# Altium schematic sheet SIM.SchDoc: Air724UG 参考设计
size 594 x 419 mm; DESIGNER: Loukanghua; REV: V1.0
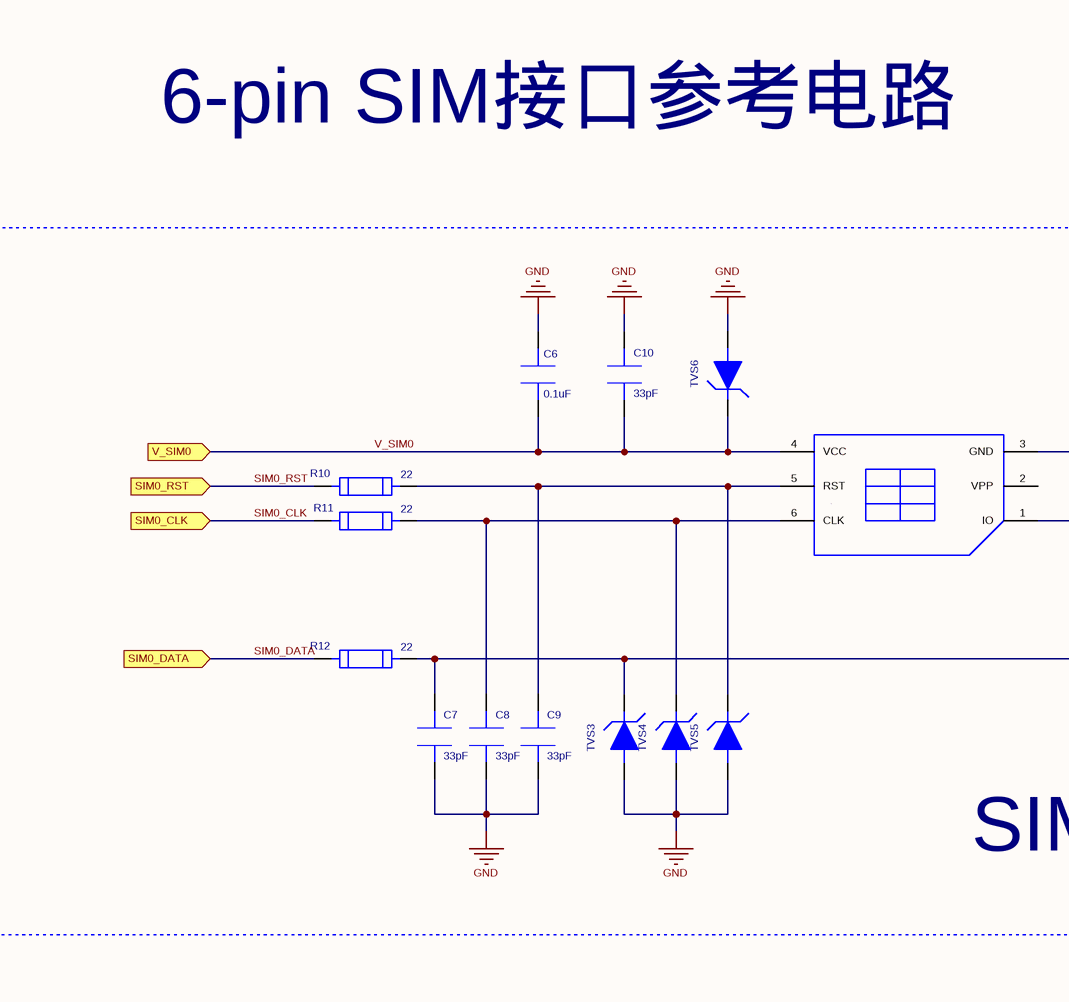
[diagram p0: SIM.SchDoc, top left]
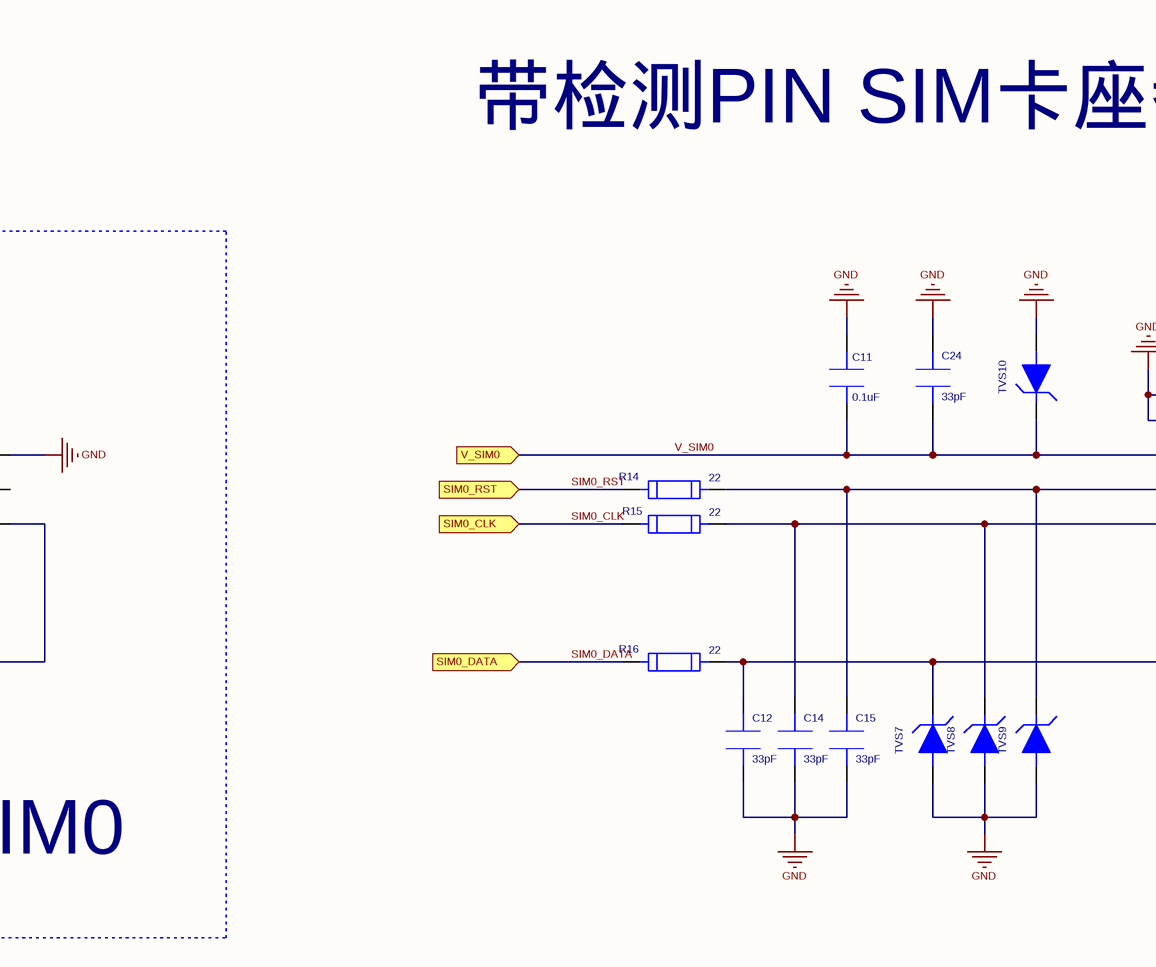
[diagram p1: SIM.SchDoc, top middle]
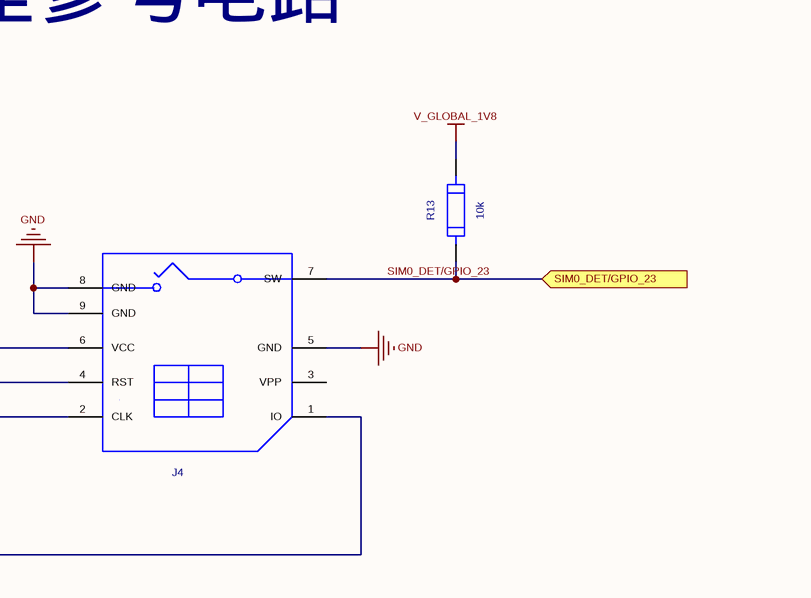
[diagram p2: SIM.SchDoc, top right]
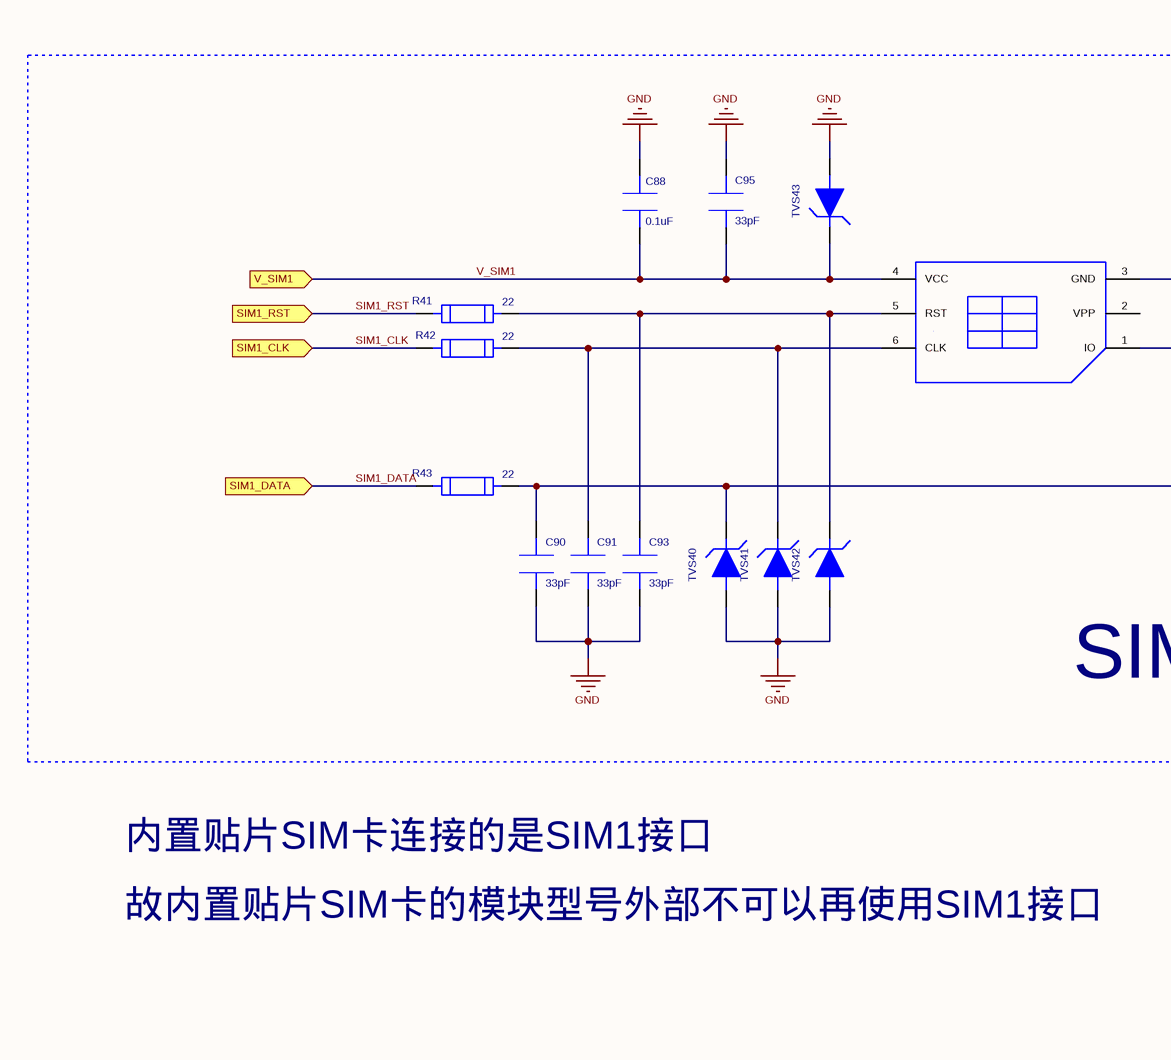
[diagram p3: SIM.SchDoc, bottom left]
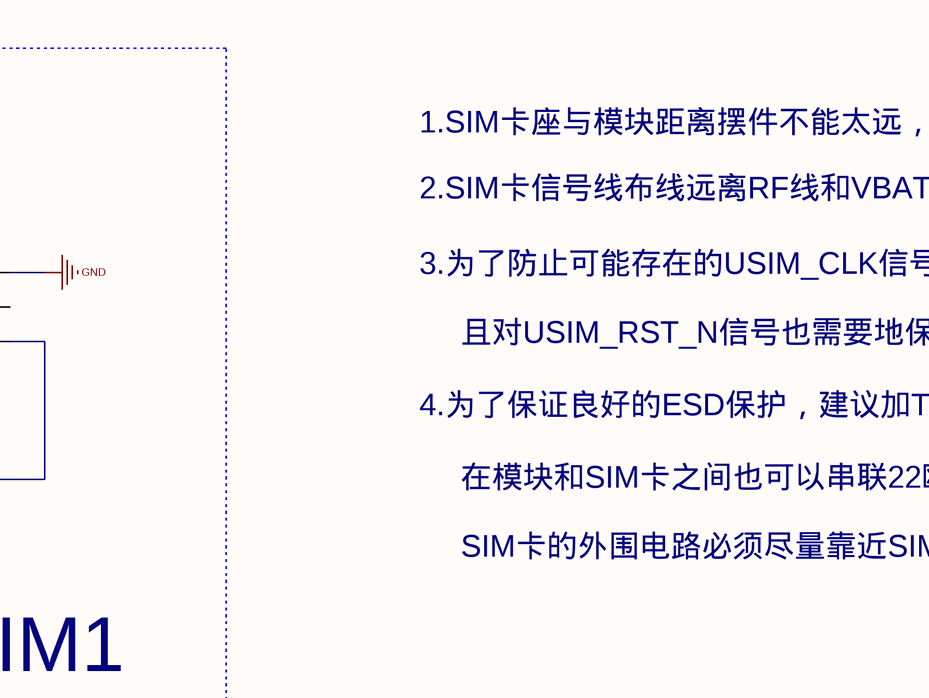
[diagram p4: SIM.SchDoc, bottom middle]
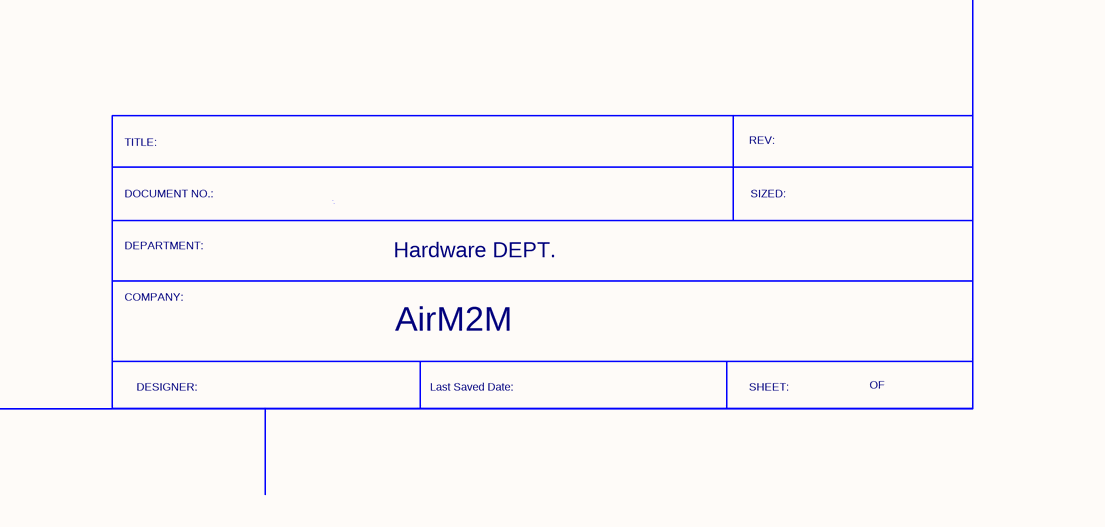
[diagram p5: SIM.SchDoc, bottom right]

## Parts
C6  value 0.1uF  [SC0402]  (hidden comment: CAP-0.1UF-0402-X5R-10V)
C7  value 33pF  [SC0402]  (hidden comment: CAP-33PF-0402-C0G)
C8  value 33pF  [SC0402]  (hidden comment: CAP-33PF-0402-C0G)
C9  value 33pF  [SC0402]  (hidden comment: CAP-33PF-0402-C0G)
C10  value 33pF  [SC0402]  (hidden comment: CAP-33PF-0402-C0G)
C11  value 0.1uF  [SC0402]  (hidden comment: CAP-0.1UF-0402-X5R-10V)
C12  value 33pF  [SC0402]  (hidden comment: CAP-33PF-0402-C0G)
C14  value 33pF  [SC0402]  (hidden comment: CAP-33PF-0402-C0G)
C15  value 33pF  [SC0402]  (hidden comment: CAP-33PF-0402-C0G)
C24  value 33pF  [SC0402]  (hidden comment: CAP-33PF-0402-C0G)
C88  value 0.1uF  [SC0402]  (hidden comment: CAP-0.1UF-0402-X5R-10V)
C90  value 33pF  [SC0402]  (hidden comment: CAP-33PF-0402-C0G)
C91  value 33pF  [SC0402]  (hidden comment: CAP-33PF-0402-C0G)
C93  value 33pF  [SC0402]  (hidden comment: CAP-33PF-0402-C0G)
C95  value 33pF  [SC0402]  (hidden comment: CAP-33PF-0402-C0G)
J2  SIMCARD6_1  [SIMCARD6]  (value not drawn)
J4  SIM-SW-CAF98-06206-XX00  [SIM-SW-CAF98-06206-XX00]  (value not drawn)
J10  SIMCARD6_1  [SIMCARD6]  (value not drawn)
R10  value 22  [SR0402]  (hidden comment: RES-22-0402)
R11  value 22  [SR0402]  (hidden comment: RES-22-0402)
R12  value 22  [SR0402]  (hidden comment: RES-22-0402)
R13  value 10k  [SR0402]  (hidden comment: RES-10K-0402)
R14  value 22  [SR0402]  (hidden comment: RES-22-0402)
R15  value 22  [SR0402]  (hidden comment: RES-22-0402)
R16  value 22  [SR0402]  (hidden comment: RES-22-0402)
R41  value 22  [SR0402]  (hidden comment: RES-22-0402)
R42  value 22  [SR0402]  (hidden comment: RES-22-0402)
R43  value 22  [SR0402]  (hidden comment: RES-22-0402)
TVS3  ESD-TVS-ESD9X5.0ST5G  [SOD-923-ESD9X5.0ST5G]  (value not drawn)
TVS4  ESD-TVS-ESD9X5.0ST5G  [SOD-923-ESD9X5.0ST5G]  (value not drawn)
TVS5  ESD-TVS-ESD9X5.0ST5G  [SOD-923-ESD9X5.0ST5G]  (value not drawn)
TVS6  ESD-TVS-ESD9X5.0ST5G  [SOD-923-ESD9X5.0ST5G]  (value not drawn)
TVS7  ESD-TVS-ESD9X5.0ST5G  [SOD-923-ESD9X5.0ST5G]  (value not drawn)
TVS8  ESD-TVS-ESD9X5.0ST5G  [SOD-923-ESD9X5.0ST5G]  (value not drawn)
TVS9  ESD-TVS-ESD9X5.0ST5G  [SOD-923-ESD9X5.0ST5G]  (value not drawn)
TVS10  ESD-TVS-ESD9X5.0ST5G  [SOD-923-ESD9X5.0ST5G]  (value not drawn)
TVS40  ESD-TVS-ESD9X5.0ST5G  [SOD-923-ESD9X5.0ST5G]  (value not drawn)
TVS41  ESD-TVS-ESD9X5.0ST5G  [SOD-923-ESD9X5.0ST5G]  (value not drawn)
TVS42  ESD-TVS-ESD9X5.0ST5G  [SOD-923-ESD9X5.0ST5G]  (value not drawn)
TVS43  ESD-TVS-ESD9X5.0ST5G  [SOD-923-ESD9X5.0ST5G]  (value not drawn)

## Blocks framed on the sheet
SIM0: C6-C10 J2 R10-R12 TVS3-TVS6
SIM1: C88 C90 C91 C93 C95 J10 R41-R43 TVS40-TVS43

## Ports
SIM0_CLK, SIM0_DATA, SIM0_DET/GPIO_23, SIM0_RST, SIM1_CLK, SIM1_DATA, SIM1_RST, V_SIM0, V_SIM1

## Nets
GND: C6.2 C7.2 C8.2 C9.2 C10.1 C11.2 C12.2 C14.2 C15.2 C24.1 C88.2 C90.2 C91.2 C93.2 C95.1 J2.3(GND) J4.5(GND) J4.8(GND) J4.9(GND) J10.3(GND) TVS3.2 TVS4.2 TVS5.2 TVS6.2 TVS7.2 TVS8.2 TVS9.2 TVS10.2 TVS40.2 TVS41.2 TVS42.2 TVS43.2
V_GLOBAL_1V8: R13.2
SIM0_CLK: R11.1 R15.1 ; port SIM0_CLK
SIM0_DATA: R12.1 R16.1 ; port SIM0_DATA
SIM0_DET/GPIO_23: J4.7(SW) R13.1 ; port SIM0_DET/GPIO_23
SIM0_RST: R10.1 R14.1 ; port SIM0_RST
SIM1_CLK: R42.1 ; port SIM1_CLK
SIM1_DATA: R43.1 ; port SIM1_DATA
SIM1_RST: R41.1 ; port SIM1_RST
V_SIM0: C6.1 C10.2 C11.1 C24.2 J2.4(VCC) J4.6(VCC) TVS6.1 TVS10.1 ; port V_SIM0
V_SIM1: C88.1 C95.2 J10.4(VCC) TVS43.1 ; port V_SIM1
NetC7_1: C7.1 J2.1(IO) R12.2 TVS3.1
NetC8_1: C8.1 J2.6(CLK) R11.2 TVS4.1
NetC9_1: C9.1 J2.5(RST) R10.2 TVS5.1
NetC12_1: C12.1 J4.1(IO) R16.2 TVS7.1
NetC14_1: C14.1 J4.2(CLK) R15.2 TVS8.1
NetC15_1: C15.1 J4.4(RST) R14.2 TVS9.1
NetC90_1: C90.1 J10.1(IO) R43.2 TVS40.1
NetC91_1: C91.1 J10.6(CLK) R42.2 TVS41.1
NetC93_1: C93.1 J10.5(RST) R41.2 TVS42.1

Not connected (* = marked no-connect by the designer): J2 2(VPP); J4 3(VPP); J10 2(VPP)

## Notes on the sheet
- 6-pin SIM接口参考电路
- 带检测PIN SIM卡座参考电路
- 1.SIM卡座与模块距离摆件不能太远，越近越好，尽量保证SIM卡信号线布线不超过20cm；
- 2.SIM卡信号线布线远离RF线和VBAT电源线；
- 3.为了防止可能存在的USIM_CLK信号对USIM_DATA信号的串扰，两者布线不要太靠近，在两条走线之间增加地屏蔽。
- 且对USIM_RST_N信号也需要地保护;
- 4.为了保证良好的ESD保护，建议加TVS管，并靠近SIM卡座摆放。选择的ESD器件寄生电容不大于50pF。
- 在模块和SIM卡之间也可以串联22欧姆的电阻用以抑制杂散EMI，增强ESD防护。
- SIM卡的外围电路必须尽量靠近SIM卡座。
- 内置贴片SIM卡连接的是SIM1接口
- 故内置贴片SIM卡的模块型号外部不可以再使用SIM1接口
- TITLE:
- REV:
- DEPARTMENT:
- DOCUMENT NO.:
- Hardware DEPT.
- SIZED:
- COMPANY:
- AirM2M
- DESIGNER:
- Last Saved Date:
- SHEET:
- OF

## Library data of the parts
C6 C11 C88 = CAP-0.1UF-0402-X5R-10V: CAP CER X5R/X7R;0.1uF;+/-10%;10V;0402;0.5mm;ROHS; Manufacture 1: Murata;Yageo;Walsin;Eyang; Manufacture 1 P/N: GRM155R61A104K****;GRM155R71A104K****;CC0402KRX5R6BB104;0402X104K100CT;C0402X5R104K100N*; Geometry.Height: 0.55mm; Serial Number: 80214720001; Tolerance: +/-10%; PCB DECAL: SC0402
C7-C10 C12 C14 C15 C24 C90 C91 C93 C95 = CAP-33PF-0402-C0G: CAP CER C0G;33PF;+/-5%;50V;0402;0.5mm;ROHS; Manufacture 1: MURATA;Yageo;Eyang; Manufacture 1 P/N: GRM1555C1H330J****;CC0402JRNPO9BN330;C0402C0G330J500N*; Geometry.Height: 0.55mm; Serial Number: 80214650008; Tolerance: +/-5%; PCB DECAL: SC0402
J2 J10 = SIMCARD6_1: SIM?座;6PIN;17.70*8.30*3.60mm;ROHS; Manufacture 1: 皇泽;; Manufacture 1 P/N: SIMWH-03605-TP00; Serial Number: 81300000026; Geometry.Height: 3.6mm; PCB DECAL: SIMCARD6
J4 = SIM-SW-CAF98-06206-XX00: SIM卡座;8PIN;PUSH TO PUSH;26.6*19.1*2.1mm;ROHS; Manufacture 1 P/N: CAF98-06206-S100; Manufacture 1: 乾德电子(Linkconn);; Geometry.Height: 2.1mm; Serial Number: 81330000088; PCB DECAL: SIM-SW-CAF98-06206-XX00
R10-R12 R14-R16 R41-R43 = RES-22-0402: RES FILM;22;+/-5%;1/16W;0402;0.4mm;ROHS; Manufacture 1 P/N: RC0402JR-0722RL; Manufacture 1: YAGEO; Serial Number: 80114640035; Geometry.Height: 0.4mm; Tolerance: +/-5%; PCB DECAL: SR0402
R13 = RES-10K-0402: RES FILM;10K;+/-5%;1/16W;0402;0.4mm;ROHS; Manufacture 1 P/N: RC0402JR-0710KL;WR04X103_JTL; Manufacture 1: YAGEO;Walsin; Serial Number: 80114640004; Geometry.Height: 0.4mm; Tolerance: +/-5%; PCB DECAL: SR0402
TVS3-TVS10 TVS40-TVS43 = ESD-TVS-ESD9X5.0ST5G: TVS;5.0V;65PF;SOD?923;ROHS; Manufacture 1: ONSEMI; Geometry.Height: 0.43mm; Serial Number: 81121000001; Manufacture 1 P/N: ESD9X5.0ST5G; PCB DECAL: SOD-923-ESD9X5.0ST5G